# Altium schematic sheet Sheet1.SchDoc
size A4; SheetNumber: 1; SheetTotal: 1
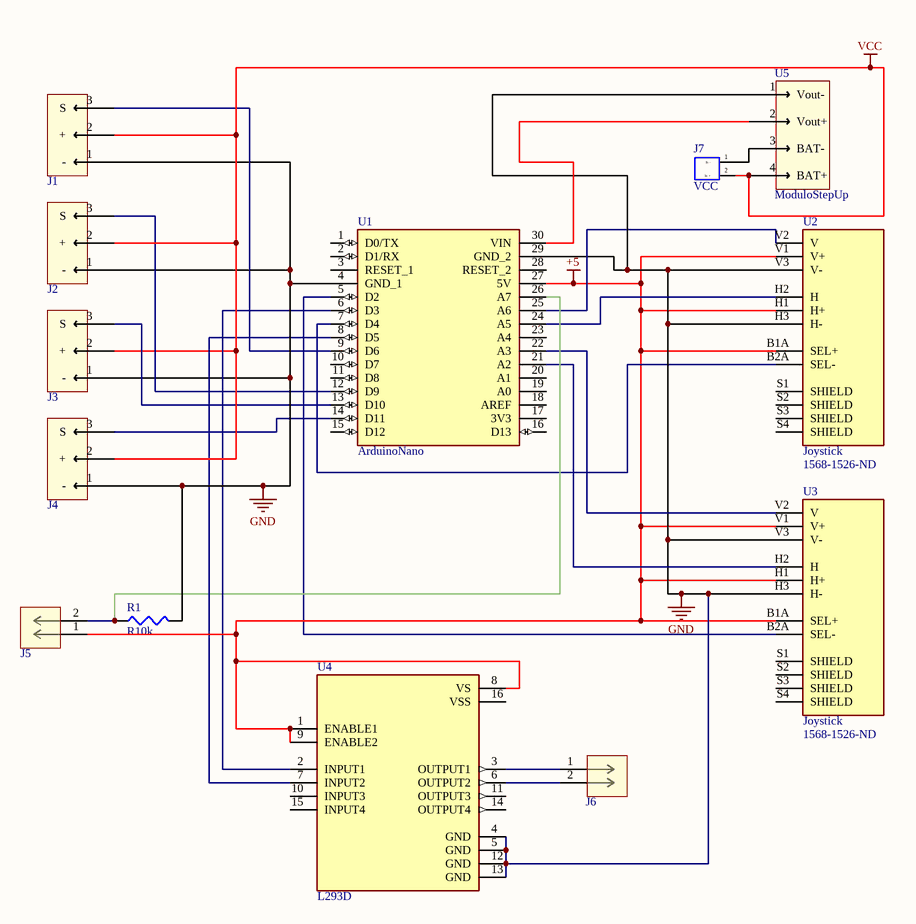
[diagram p0: Sheet1.SchDoc]

## Parts
J1  HDR1x3  [HDR1x3]  (value not drawn)
J2  HDR1x3  [HDR1x3]  (value not drawn)
J3  HDR1x3  [HDR1x3]  (value not drawn)
J4  HDR1x3  [HDR1x3]  (value not drawn)
J5  Header 2x1  [2pin]  (value not drawn)
J6  Header 2x1  [2pin]  (value not drawn)
J7  VCC  [TerminalBlock2Pos]
R1  R10k  [R10k]
U1  ArduinoNano  [ArduinoNano]
U2  Joystick  Supplier Part Number 1: 1568-1526-ND  [Joystick]
U3  Joystick  Supplier Part Number 1: 1568-1526-ND  [Joystick]
U4  L293D  [L293D]
U5  ModuloStepUp  [StepUp]

## Nets
+5: J5.1 U1.27(5V) U2.B1A(SEL+) U2.H1(H+) U2.V1(V+) U3.B1A(SEL+) U3.H1(H+) U3.V1(V+) U4.1(ENABLE1) U4.8(VS) U4.9(ENABLE2)
GND: J1.1(-) J2.1(-) J3.1(-) J4.1(-) R1.2 U1.4(GND_1) U1.29(GND_2) U2.H3(H-) U2.V3(V-) U3.H3(H-) U3.V3(V-) U4.4(GND) U4.5(GND) U4.12(GND) U4.13(GND) U5.1(Vout-)
VCC: J1.2(+) J2.2(+) J3.2(+) J4.2(+) J7.2(In_+) U5.4(BAT+)
NetJ1_3: J1.3(S) U1.9(D6)
NetJ2_3: J2.3(S) U1.12(D9)
NetJ3_3: J3.3(S) U1.13(D10)
NetJ4_3: J4.3(S) U1.14(D11)
NetJ5_2: J5.2 R1.1 U1.26(A7)
NetJ6_1: J6.1 U4.3(OUTPUT1)
NetJ6_2: J6.2 U4.6(OUTPUT2)
NetJ7_1: J7.1(In_-) U5.3(BAT-)
NetU1_5: U1.5(D2) U3.B2A(SEL-)
NetU1_6: U1.6(D3) U4.2(INPUT1)
NetU1_7: U1.7(D4) U2.B2A(SEL-)
NetU1_8: U1.8(D5) U4.7(INPUT2)
NetU1_21: U1.21(A2) U3.H2(H)
NetU1_22: U1.22(A3) U3.V2(V)
NetU1_24: U1.24(A5) U2.H2(H)
NetU1_25: U1.25(A6) U2.V2(V)
NetU1_30: U1.30(VIN) U5.2(Vout+)

Not connected (* = marked no-connect by the designer): U1 1(D0/TX) 2(D1/RX) 3(RESET_1) 10(D7) 11(D8) 15(D12) 16(D13) 17(3V3) 18(AREF) 19(A0) 20(A1) 23(A4) 28(RESET_2); U2 S1(SHIELD) S2(SHIELD) S3(SHIELD) S4(SHIELD); U3 S1(SHIELD) S2(SHIELD) S3(SHIELD) S4(SHIELD); U4 10(INPUT3) 11(OUTPUT3) 14(OUTPUT4) 15(INPUT4) 16(VSS)

## Library data of the parts
J1-J4 = H3x1: THT Vertical Pin Header WR-PHD, Pitch 2.54 mm, Single Row, 3 pins; Manufacturer: Wurth Electronics; Manufacturer Part Number: 61300311121; Number of Positions: 3; Gender: Male; Contact Resistance: 20mR; Current Rating: 3A; Voltage Rating: 250V; Pitch: 0.1inch; Supplier 1: Digikey; RoHS: Yes; Category: Connectors; Stock 1: 144979; Pricing 1: 1=0,13, 10=0,113, 25=0,094, 50=0,079, 100=0,071, 1000=0,066 (USD); Mount: Through Hole; Contact Plating: Gold; Contact Material: Copper; Color: Black; Min Operating Temperature: -40°C; Max Operating Temperature: 105°C; Number of Rows: 1; Packaging: Bulk; Termination: Solder; Number of Contacts: 3; Series: WR-PHD; Contact Type: Male Pin; Operating Supply Voltage: 250V; Orientation: 5495OrientationType; Height: 8.94mm; Contact Mating Length: 0.236inch; Lead Free: Lead Free; RoHS Compliant: Yes; Reach SVHC Compliant: Unknown; ComponentLink1URL: https://katalog.we-online.de/em/datasheet/6130xx11121.pdf?src-supplier=Digikey; ComponentLink1Description: https://katalog.we-online.de/em/datasheet/6130xx11121.pdf?src-supplier=Digikey; ComponentLink2URL: http://www.farnell.com/cad/1737268.pdf?src-supplier=Element14; ComponentLink2Description: http://www.farnell.com/cad/1737268.pdf?src-supplier=Element14; ComponentLink3URL: https://datasheet.octopart.com/61300311121-W%C3%BCrth-Elektronik-datasheet-21154836.pdf?src-supplier=Element14; ComponentLink3Description: https://datasheet.octopart.com/61300311121-W%C3%BCrth-Elektronik-datasheet-21154836.pdf?src-supplier=Element14; Supplier Part Number 1: 732-5316-ND
J5 J6 = H2x1: No Description Available; Mfr_Name: Wurth Electronics; RefDes: RefDes; Type: Type
J7 = Bat
U1 = ArduinoNano: Small, complete, and breadboard-friendly board based on the ATmega328 (Arduino Nano 3.x).; MP: A000005; Check_prices: https://www.snapeda.com/parts/A000005/Arduino/view-part/?ref=eda; Value: *; Availability: In Stock; Price: None; Package: Non-Standard Arduino; SnapEDA_Link: https://www.snapeda.com/parts/A000005/Arduino/view-part/?ref=snap; Purchase-URL: https://pricing.snapeda.com/search/part/A000005/?ref=eda; MF: Arduino
U2 U3 = Joystick: Thumb Joystick; MP: COM-09032; Price: None; Availability: Unavailable; Value: *; Package: None; Supplier 1: Digikey
U4 = L293D: Bipolar Motor Driver - Parallel 16-PowerDIP; MF: STMicroelectronics; MP: L293D; Package: DIP-16 STMicroelectronics; SnapEDA_Link: https://www.snapeda.com/parts/L293D/STMicroelectronics/view-part/?ref=snap; Purchase-URL: https://pricing.snapeda.com/search/part/L293D/?ref=eda; Check_prices: https://www.snapeda.com/parts/L293D/STMicroelectronics/view-part/?ref=eda; Availability: In Stock; Value: *; Price: None
R1 = R10k: Supplier 1: Digikey; Supplier Part Number 1: RNF14FTD10K0CT-ND